# Altium project MPCT_v3_Ajna.PrjPcb
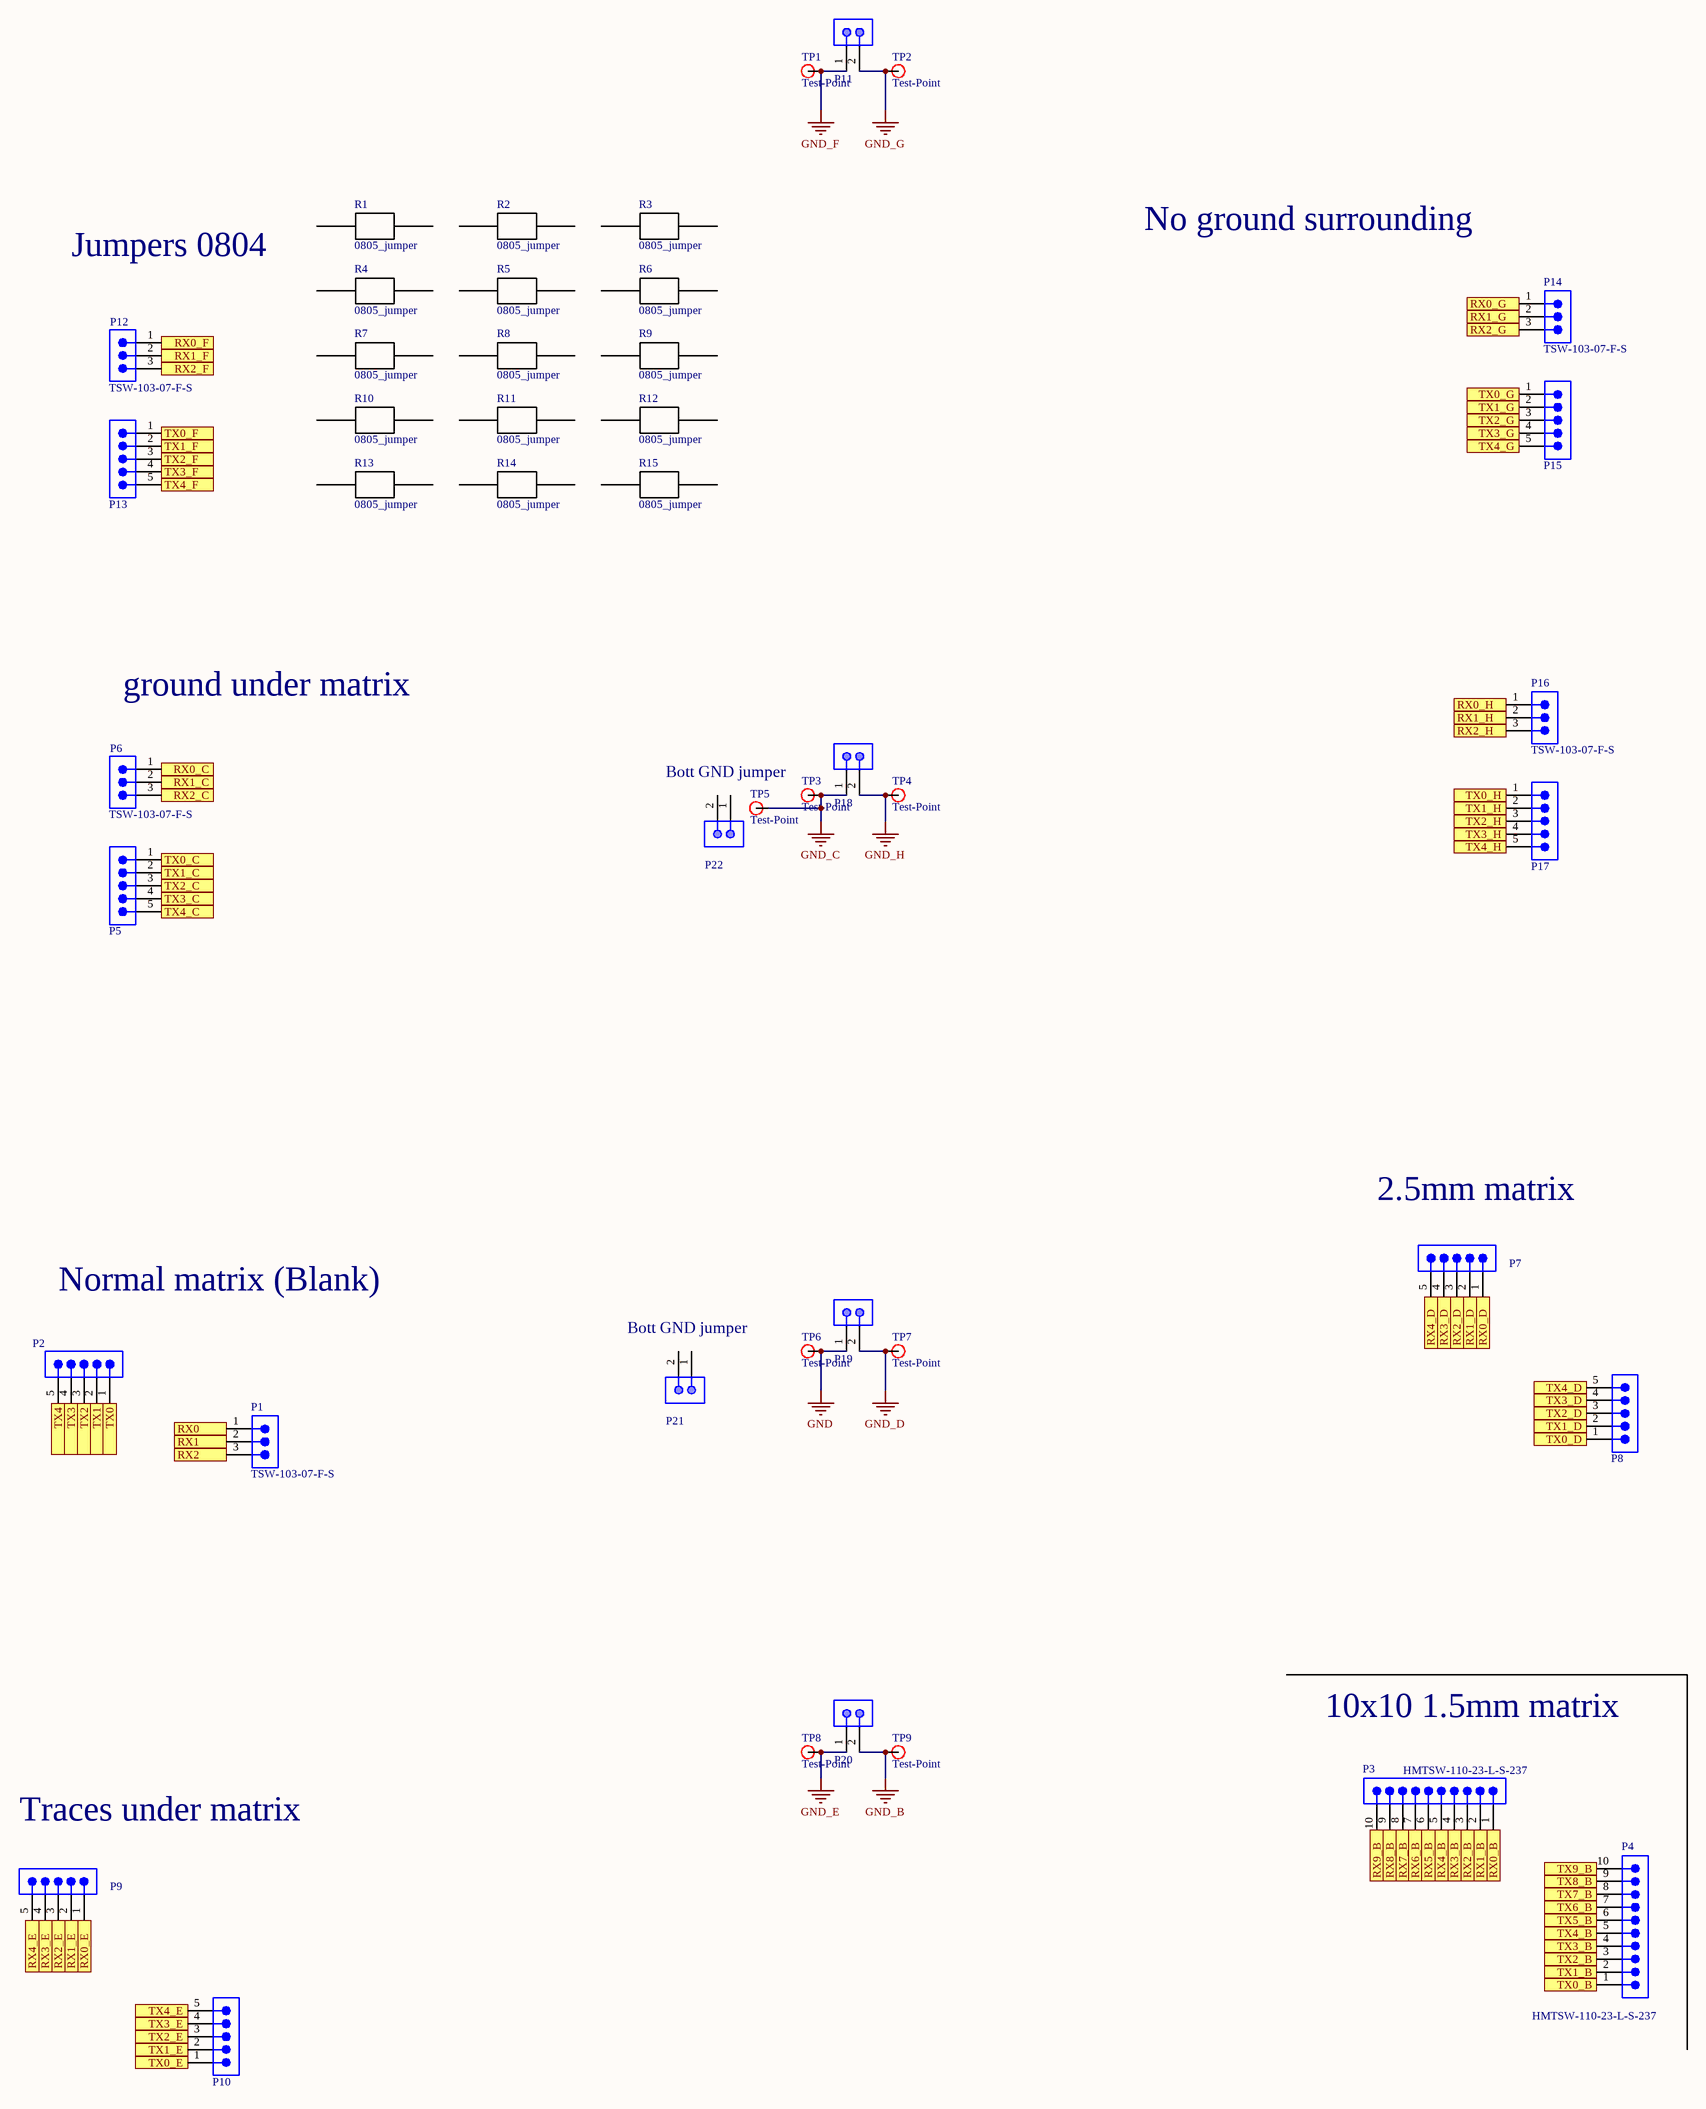
[diagram p0: touchpads.SchDoc]
1 sheet, 46 parts. Net scope: flat (ports and power ports of the same name join across sheets).
Board file: MPCT_3.PcbDoc

## Sheet touchpads.SchDoc
size A2 portrait

### Parts
P1  TSW-103-07-F-S  [SMTC-TSW-103-07-X-S]
P2  MTLW-105-05-L-S-190  [SMTC-MTLW-105-05-X-S-190]  (value not drawn)
P3  HMTSW-110-23-L-S-237  [SMTC-HMTSW-110-23-X-S-237]
P4  HMTSW-110-23-L-S-237  [SMTC-HMTSW-110-23-X-S-237]
P5  MTLW-105-05-L-S-190  [SMTC-MTLW-105-05-X-S-190]  (value not drawn)
P6  TSW-103-07-F-S  [SMTC-TSW-103-07-X-S]
P7  MTLW-105-05-L-S-190  [SMTC-MTLW-105-05-X-S-190]  (value not drawn)
P8  MTLW-105-05-L-S-190  [SMTC-MTLW-105-05-X-S-190]  (value not drawn)
P9  MTLW-105-05-L-S-190  [SMTC-MTLW-105-05-X-S-190]  (value not drawn)
P10  MTLW-105-05-L-S-190  [SMTC-MTLW-105-05-X-S-190]  (value not drawn)
P11  613 002 111 21  [WE-61300211121_V]  (value not drawn)
P12  TSW-103-07-F-S  [SMTC-TSW-103-07-X-S]
P13  MTLW-105-05-L-S-190  [SMTC-MTLW-105-05-X-S-190]  (value not drawn)
P14  TSW-103-07-F-S  [SMTC-TSW-103-07-X-S]
P15  MTLW-105-05-L-S-190  [SMTC-MTLW-105-05-X-S-190]  (value not drawn)
P16  TSW-103-07-F-S  [SMTC-TSW-103-07-X-S]
P17  MTLW-105-05-L-S-190  [SMTC-MTLW-105-05-X-S-190]  (value not drawn)
P18  613 002 111 21  [WE-61300211121_V]  (value not drawn)
P19  613 002 111 21  [WE-61300211121_V]  (value not drawn)
P20  613 002 111 21  [WE-61300211121_V]  (value not drawn)
P21  613 002 111 21  [WE-61300211121_V]  (value not drawn)
P22  613 002 111 21  [WE-61300211121_V]  (value not drawn)
R1  0805_jumper  [Resistor]
R2  0805_jumper  [Resistor]
R3  0805_jumper  [Resistor]
R4  0805_jumper  [Resistor]
R5  0805_jumper  [Resistor]
R6  0805_jumper  [Resistor]
R7  0805_jumper  [Resistor]
R8  0805_jumper  [Resistor]
R9  0805_jumper  [Resistor]
R10  0805_jumper  [Resistor]
R11  0805_jumper  [Resistor]
R12  0805_jumper  [Resistor]
R13  0805_jumper  [Resistor]
R14  0805_jumper  [Resistor]
R15  0805_jumper  [Resistor]
TP1  Test-Point  [Test-Point-Footprint-1]
TP2  Test-Point  [Test-Point-Footprint-1]
TP3  Test-Point  [Test-Point-Footprint-1]
TP4  Test-Point  [Test-Point-Footprint-1]
TP5  Test-Point  [Test-Point-Footprint-1]
TP6  Test-Point  [Test-Point-Footprint-1]
TP7  Test-Point  [Test-Point-Footprint-1]
TP8  Test-Point  [Test-Point-Footprint-1]
TP9  Test-Point  [Test-Point-Footprint-1]

### Ports
RX0 (in), RX0_B (in), RX0_C (in), RX0_D (in), RX0_E (in), RX0_F (in), RX0_G (in), RX0_H (in), RX1 (in), RX1_B (in), RX1_C (in), RX1_D (in), RX1_E (in), RX1_F (in), RX1_G (in), RX1_H (in), RX2 (in), RX2_B (in), RX2_C (in), RX2_D (in), RX2_E (in), RX2_F (in), RX2_G (in), RX2_H (in), RX3_B (in), RX3_D (in), RX3_E (in), RX4_B (in), RX4_D (in), RX4_E (in), RX5_B (in), RX6_B (in), RX7_B (in), RX8_B (in), RX9_B (in), TX0 (out), TX0_B (out), TX0_C (out), TX0_D (out), TX0_E (out), TX0_F (out), TX0_G (out), TX0_H (out), TX1 (out), TX1_B (out), TX1_C (out), TX1_D (out), TX1_E (out), TX1_F (out), TX1_G (out), TX1_H (out), TX2 (out), TX2_B (out), TX2_C (out), TX2_D (out), TX2_E (out), TX2_F (out), TX2_G (out), TX2_H (out), TX3 (out), TX3_B (out), TX3_C (out), TX3_D (out), TX3_E (out), TX3_F (out), TX3_G (out), TX3_H (out), TX4 (out), TX4_B (out), TX4_C (out), TX4_D (out), TX4_E (out), TX4_F (out), TX4_G (out), TX4_H (out), TX5_B (out), TX6_B (out), TX7_B (out), TX8_B (out), TX9_B (out)

### Nets
GND: P19.1 TP6.1
GND_B: P20.2 TP9.1
GND_C: P18.1 TP3.1 TP5.1
GND_D: P19.2 TP7.1
GND_E: P20.1 TP8.1
GND_F: P11.1 TP1.1
GND_G: P11.2 TP2.1
GND_H: P18.2 TP4.1
RX0: P1.1 ; port RX0
RX0_B: P3.1 ; port RX0_B
RX0_C: P6.1 ; port RX0_C
RX0_D: P7.1 ; port RX0_D
RX0_E: P9.1 ; port RX0_E
RX0_F: P12.1 ; port RX0_F
RX0_G: P14.1 ; port RX0_G
RX0_H: P16.1 ; port RX0_H
RX1: P1.2 ; port RX1
RX1_B: P3.2 ; port RX1_B
RX1_C: P6.2 ; port RX1_C
RX1_D: P7.2 ; port RX1_D
RX1_E: P9.2 ; port RX1_E
RX1_F: P12.2 ; port RX1_F
RX1_G: P14.2 ; port RX1_G
RX1_H: P16.2 ; port RX1_H
RX2: P1.3 ; port RX2
RX2_B: P3.3 ; port RX2_B
RX2_C: P6.3 ; port RX2_C
RX2_D: P7.3 ; port RX2_D
RX2_E: P9.3 ; port RX2_E
RX2_F: P12.3 ; port RX2_F
RX2_G: P14.3 ; port RX2_G
RX2_H: P16.3 ; port RX2_H
RX3_B: P3.4 ; port RX3_B
RX3_D: P7.4 ; port RX3_D
RX3_E: P9.4 ; port RX3_E
RX4_B: P3.5 ; port RX4_B
RX4_D: P7.5 ; port RX4_D
RX4_E: P9.5 ; port RX4_E
RX5_B: P3.6 ; port RX5_B
RX6_B: P3.7 ; port RX6_B
RX7_B: P3.8 ; port RX7_B
RX8_B: P3.9 ; port RX8_B
RX9_B: P3.10 ; port RX9_B
TX0: P2.1 ; port TX0
TX0_B: P4.1 ; port TX0_B
TX0_C: P5.1 ; port TX0_C
TX0_D: P8.1 ; port TX0_D
TX0_E: P10.1 ; port TX0_E
TX0_F: P13.1 ; port TX0_F
TX0_G: P15.1 ; port TX0_G
TX0_H: P17.1 ; port TX0_H
TX1: P2.2 ; port TX1
TX1_B: P4.2 ; port TX1_B
TX1_C: P5.2 ; port TX1_C
TX1_D: P8.2 ; port TX1_D
TX1_E: P10.2 ; port TX1_E
TX1_F: P13.2 ; port TX1_F
TX1_G: P15.2 ; port TX1_G
TX1_H: P17.2 ; port TX1_H
TX2: P2.3 ; port TX2
TX2_B: P4.3 ; port TX2_B
TX2_C: P5.3 ; port TX2_C
TX2_D: P8.3 ; port TX2_D
TX2_E: P10.3 ; port TX2_E
TX2_F: P13.3 ; port TX2_F
TX2_G: P15.3 ; port TX2_G
TX2_H: P17.3 ; port TX2_H
TX3: P2.4 ; port TX3
TX3_B: P4.4 ; port TX3_B
TX3_C: P5.4 ; port TX3_C
TX3_D: P8.4 ; port TX3_D
TX3_E: P10.4 ; port TX3_E
TX3_F: P13.4 ; port TX3_F
TX3_G: P15.4 ; port TX3_G
TX3_H: P17.4 ; port TX3_H
TX4: P2.5 ; port TX4
TX4_B: P4.5 ; port TX4_B
TX4_C: P5.5 ; port TX4_C
TX4_D: P8.5 ; port TX4_D
TX4_E: P10.5 ; port TX4_E
TX4_F: P13.5 ; port TX4_F
TX4_G: P15.5 ; port TX4_G
TX4_H: P17.5 ; port TX4_H
TX5_B: P4.6 ; port TX5_B
TX6_B: P4.7 ; port TX6_B
TX7_B: P4.8 ; port TX7_B
TX8_B: P4.9 ; port TX8_B
TX9_B: P4.10 ; port TX9_B

Not connected (* = marked no-connect by the designer): P21 1 2; P22 1 2; R1 31 32; R2 31 32; R3 31 32; R4 31 32; R5 31 32; R6 31 32; R7 31 32; R8 31 32; R9 31 32; R10 31 32; R11 31 32; R12 31 32; R13 31 32; R14 31 32; R15 31 32

### Notes on the sheet
- No ground surrounding
- Jumpers 0804
- ground under matrix
- Bott GND jumper
- 2.5mm matrix
- Normal matrix (Blank)
- 10x10 1.5mm matrix
- Traces under matrix
- Title
- Size:
- Date:
- File:
- A2
- Number:
- Time:
- Revision:
- Sheet
- of

### Library data of the parts
P1 P6 P12 P14 P16 = CMP-1024-00331-1: 0.025" SQ Post Header, Through-hole, Vertical, -55 to 125 degC, 2.54 mm Pitch, 3-Pin, Male, RoHS; Manufacturer: Samtec; Pitch: 2.54 mm; DatasheetVersion: F-214; ComponentLink1Description: Manufacturer URL; ComponentLink3URL: http://www.samtec.com/documents/webfiles/cpdf/TSW-XXX-XX-XXX-X-XX-XXX-MKT.pdf; Mounting Technology: Through-hole; PackageDescription: .025[0.64] SQ. Post Terminal Strip Assembly; Temperature Range: -55 to 125 degC; ComponentLink3Description: Package Specification; Orientation: Vertical; PartNumber: TSW-103-07-F-S; RoHS: True; PackageVersion: DM, 8/1988; ComponentLink2Description: Datasheet; ComponentLink1URL: http://www.samtec.com; ComponentLink2URL: http://www.samtec.com/documents/webfiles/pdf/TSW_TH.PDF; PackageReference: TSW-103-07-X-S
P2 P5 P7-P10 P13 P15 P17 = CMP-1024-00079-1: Low Profile .025" SQ Post Header, Through-hole, Vertical, -55 to 125 degC, 2.54 mm Pitch, 5-Pin, Male, RoHS; Manufacturer: Samtec; Pitch: 2.54 mm; Mounting Technology: Through-hole; ComponentLink2Description: Datasheet; DatasheetVersion: F-214; Temperature Range: -55 to 125 degC; ComponentLink1Description: Manufacturer URL; Orientation: Vertical; ComponentLink2URL: http://www.samtec.com/documents/webfiles/pdf/MTLW_TH.PDF; PackageDescription: Low Profile Terminal Assembly; PackageVersion: T, 6/1991; RoHS: True; ComponentLink3Description: Package Specification; ComponentLink1URL: http://www.samtec.com; PackageReference: MTLW-105-05-X-S-190; ComponentLink3URL: http://www.samtec.com/documents/webfiles/cpdf/MTLW-1XX-XX-XX-X-XXX-XX-XX-MKT1.pdf; PartNumber: MTLW-105-05-L-S-190
P3 P4 = CMP-1024-00031-1: Modified .025" SQ Post Header, Through-hole, Vertical, -55 to 125 degC, 2.54 mm Pitch, 10-Pin, Male, RoHS; Manufacturer: Samtec; Pitch: 2.54 mm; ComponentLink2URL: http://www.samtec.com/documents/webfiles/pdf/HMTSW.PDF; ComponentLink3Description: Package Specification; ComponentLink1URL: http://www.samtec.com; ComponentLink1Description: Manufacturer URL; DatasheetVersion: F-214; RoHS: True; Mounting Technology: Through-hole; PackageDescription: Assembly .025 [.64] SQ. Post Hi-Temp Terminal Strip; PackageReference: HMTSW-110-23-X-S-237; Temperature Range: -55 to 125 degC; ComponentLink2Description: Datasheet; ComponentLink3URL: http://www.samtec.com/documents/webfiles/cpdf/HMTSW-XXX-XX-X-X-XXXX-XX-XX-MKT1.pdf; Orientation: Vertical; PartNumber: HMTSW-110-23-L-S-237; PackageVersion: AL, 3/1987
P11 P18-P22 = CMP-1712-00002-1: Male Header, Pitch 2.54 mm, 1 x 2 Position, Height 8.54 mm, Tail Length 3 mm, -40 to 105 degC, RoHS, Bulk; Manufacturer: Wuerth Elektronik; DatasheetVersion: Rev. J; ComponentLink1Description: Manufacturer URL; ComponentLink2URL: http://katalog.we-online.de/em/datasheet/6130xx11121.pdf; PackageReference: 61300211121; ComponentLink2Description: Datasheet; Mounting Technology: Through Hole; PackageDescription: Male Header, Pitch 2.54 mm, 1 x 2 Position, Height 8.54 mm, Tail Length 3 mm; ComponentLink1URL: https://www.we-online.com/; PartNumber: 613 002 111 21
TP1-TP9 = CMP-00027-4: SMD test pad